# Altium schematic sheet CONNECTORS.SchDoc
size 389 x 241 mm; SheetNumber: 6; SheetTotal: 7
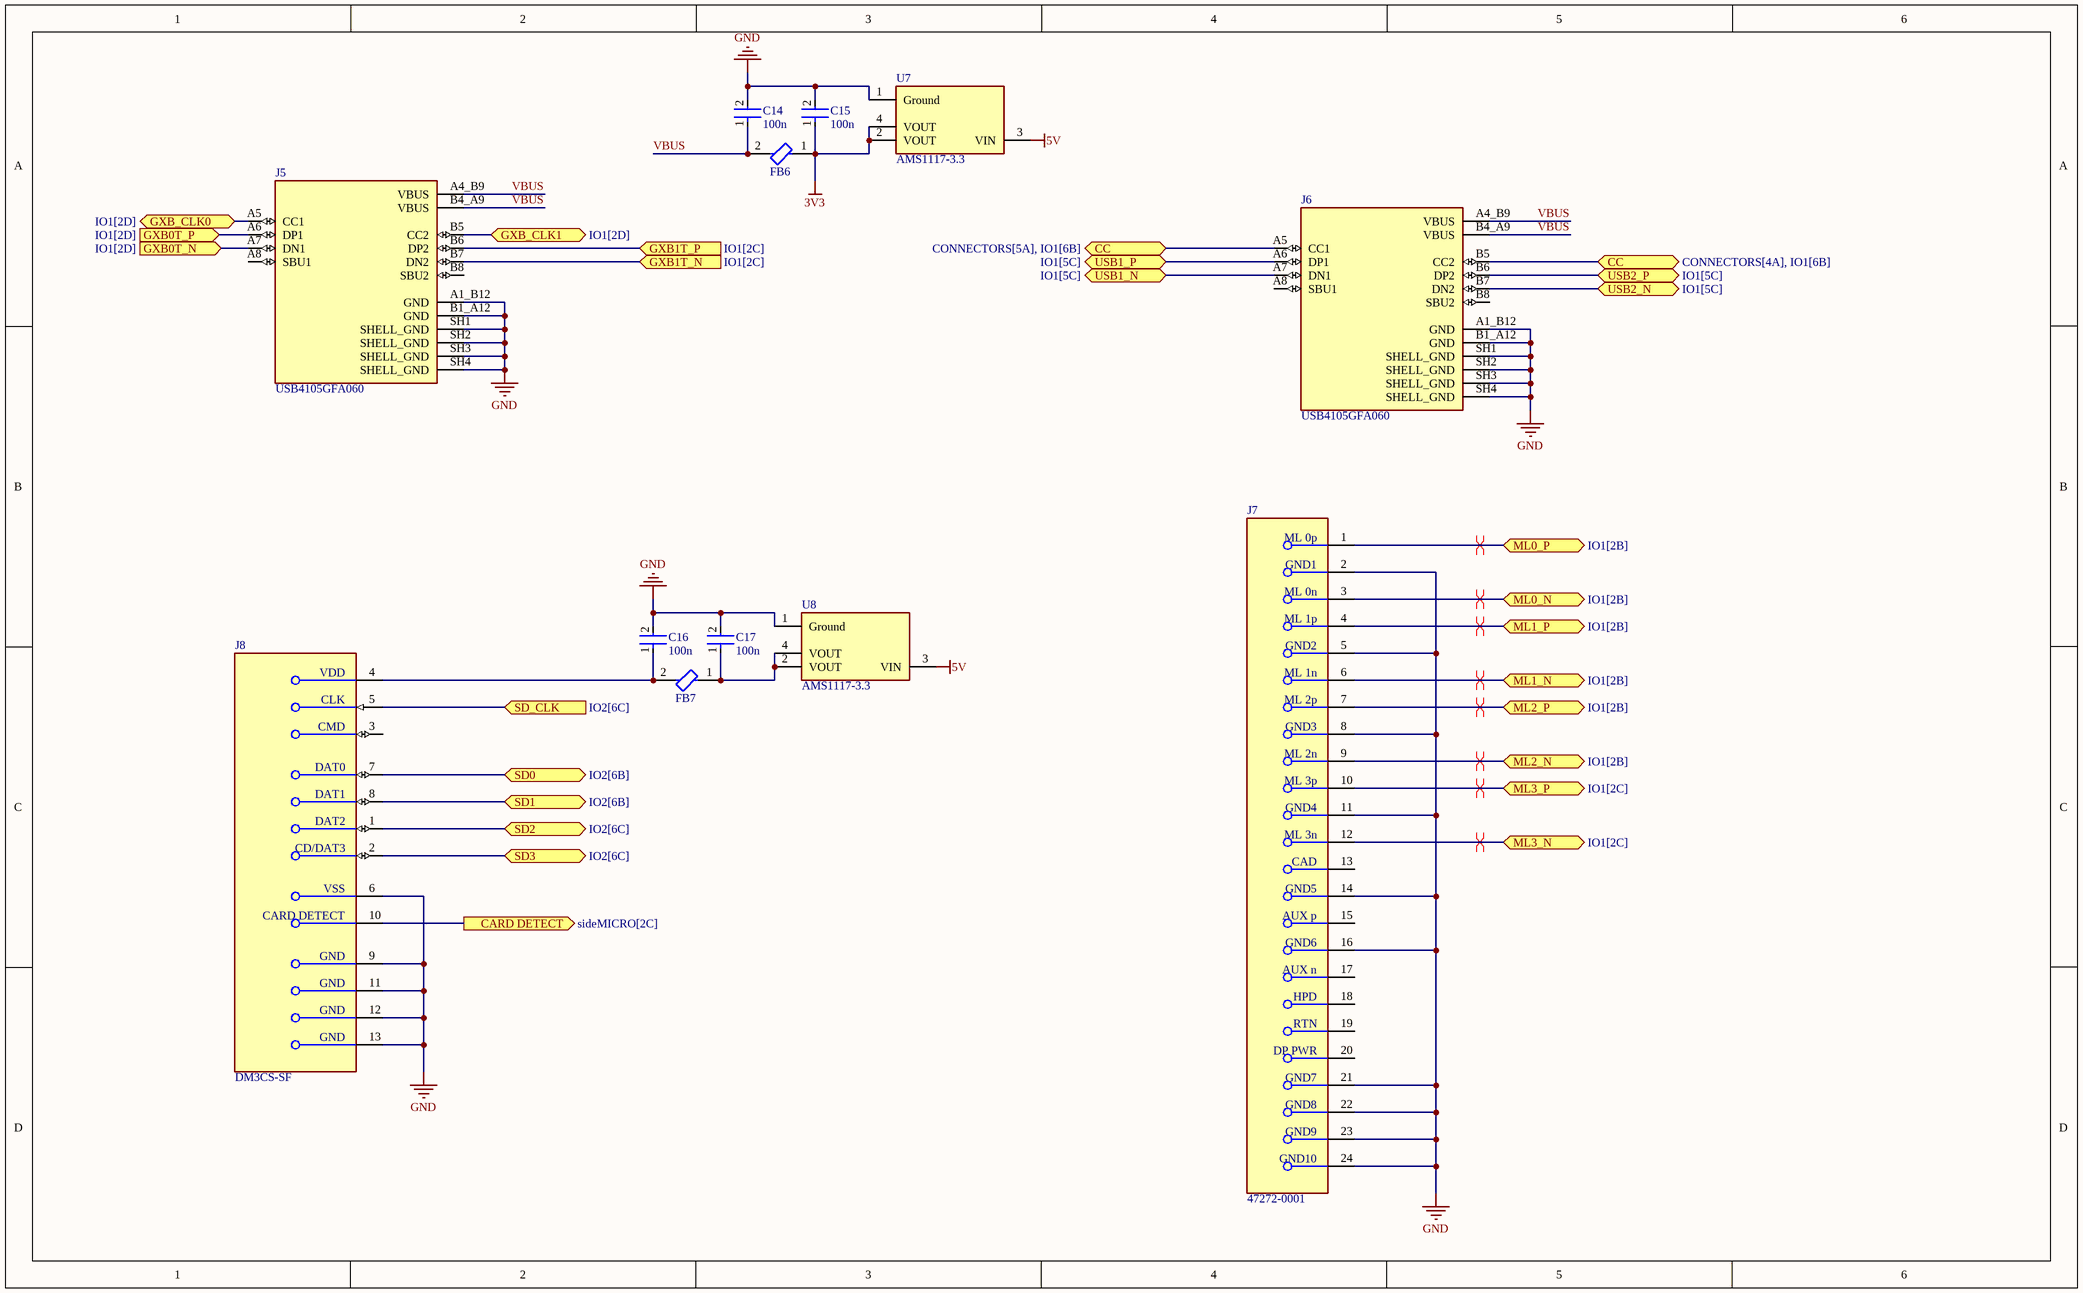
[diagram p0: CONNECTORS.SchDoc]

## Parts
C14  100n  [FP-CL10-IPC_C]
C15  100n  [FP-CL10-IPC_C]
C16  100n  [FP-CL10-IPC_C]
C17  100n  [FP-CL10-IPC_C]
FB6  BLM18KG121TN1D  [FP-BLM18-0_15-t0_6-d1_2-IPC_A]  (value not drawn)
FB7  BLM18KG121TN1D  [FP-BLM18-0_15-t0_6-d1_2-IPC_A]  (value not drawn)
J5  USB4105GFA060  [GCT_USB4105GFA060]
J6  USB4105GFA060  [GCT_USB4105GFA060]
J7  47272-0001  [FP-47272-0001-MFG]
J8  DM3CS-SF  [FP-DM3CS-SF-MFG]
U7  AMS1117-3.3  [FP-AMS1117-IPC_C]
U8  AMS1117-3.3  [FP-AMS1117-IPC_C]

## Ports
CARD DETECT (out, see sideMICRO[2C]), CC (bidir, see CONNECTORS[4A], IO1[6B]), CC (bidir, see CONNECTORS[5A], IO1[6B]), GXB0T_N (in, see IO1[2D]), GXB0T_P (in, see IO1[2D]), GXB1T_N (in, see IO1[2C]), GXB1T_P (in, see IO1[2C]), GXB_CLK0 (bidir, see IO1[2D]), GXB_CLK1 (bidir, see IO1[2D]), ML0_N (bidir, see IO1[2B]), ML0_P (bidir, see IO1[2B]), ML1_N (bidir, see IO1[2B]), ML1_P (bidir, see IO1[2B]), ML2_N (bidir, see IO1[2B]), ML2_P (bidir, see IO1[2B]), ML3_N (bidir, see IO1[2C]), ML3_P (bidir, see IO1[2C]), SD0 (bidir, see IO2[6B]), SD1 (bidir, see IO2[6B]), SD2 (bidir, see IO2[6C]), SD3 (bidir, see IO2[6C]), SD_CLK (in, see IO2[6C]), USB1_N (bidir, see IO1[5C]), USB1_P (bidir, see IO1[5C]), USB2_N (bidir, see IO1[5C]), USB2_P (bidir, see IO1[5C])

## Nets
3V3: C15.1 FB6.1 U7.2(VOUT) U7.4(VOUT)
5V: U7.3(VIN) U8.3(VIN)
GND: C14.2 C15.2 C16.2 C17.2 J5.A1_B12(GND) J5.B1_A12(GND) J5.SH1(SHELL_GND) J5.SH2(SHELL_GND) J5.SH3(SHELL_GND) J5.SH4(SHELL_GND) J6.A1_B12(GND) J6.B1_A12(GND) J6.SH1(SHELL_GND) J6.SH2(SHELL_GND) J6.SH3(SHELL_GND) J6.SH4(SHELL_GND) J7.2(GND1) J7.5(GND2) J7.8(GND3) J7.11(GND4) J7.14(GND5) J7.16(GND6) J7.21(GND7) J7.22(GND8) J7.23(GND9) J7.24(GND10) J8.6(VSS) J8.9(GND) J8.11(GND) J8.12(GND) J8.13(GND) U7.1(Ground) U8.1(Ground)
CARD DETECT: J8.10(CARD_DETECT) ; port CARD DETECT
CC: J6.A5(CC1) J6.B5(CC2) ; port CC
GXB0T_N: J5.A7(DN1) ; port GXB0T_N
GXB0T_P: J5.A6(DP1) ; port GXB0T_P
GXB1T_N: J5.B7(DN2) ; port GXB1T_N
GXB1T_P: J5.B6(DP2) ; port GXB1T_P
GXB_CLK0: J5.A5(CC1) ; port GXB_CLK0
GXB_CLK1: J5.B5(CC2) ; port GXB_CLK1
ML0_N: J7.3(ML_0n) ; port ML0_N
ML0_P: J7.1(ML_0p) ; port ML0_P
ML1_N: J7.6(ML_1n) ; port ML1_N
ML1_P: J7.4(ML_1p) ; port ML1_P
ML2_N: J7.9(ML_2n) ; port ML2_N
ML2_P: J7.7(ML_2p) ; port ML2_P
ML3_N: J7.12(ML_3n) ; port ML3_N
ML3_P: J7.10(ML_3p) ; port ML3_P
SD0: J8.7(DAT0) ; port SD0
SD1: J8.8(DAT1) ; port SD1
SD2: J8.1(DAT2) ; port SD2
SD3: J8.2(CD/DAT3) ; port SD3
SD_CLK: J8.5(CLK) ; port SD_CLK
USB1_N: J6.A7(DN1) ; port USB1_N
USB1_P: J6.A6(DP1) ; port USB1_P
USB2_N: J6.B7(DN2) ; port USB2_N
USB2_P: J6.B6(DP2) ; port USB2_P
VBUS: C14.1 FB6.2 J5.A4_B9(VBUS) J5.B4_A9(VBUS) J6.A4_B9(VBUS) J6.B4_A9(VBUS)
NetC16_1: C16.1 FB7.2 J8.4(VDD)
NetC17_1: C17.1 FB7.1 U8.2(VOUT) U8.4(VOUT)

Not connected (* = marked no-connect by the designer): J5 A8(SBU1) B8(SBU2); J6 A8(SBU1) B8(SBU2); J7 13(CAD) 15(AUX_p) 17(AUX_n) 18(HPD) 19(RTN) 20(DP_PWR); J8 3(CMD)

## Layout directives
differential pair: ML0_N, ML0_P, ML1_N, ML1_P, ML2_N, ML2_P, ML3_N, ML3_P

## Library data of the parts
C14-C17 = CMP-13271-003017-1: Cap Ceramic 4.7uF 10V X5R ±10% Pad SMD 0603 +85°C T/R; Capacitance: 4.7uF; Case/Package: 0603; Packaging: Tape and Reel; Width: 0.031inch; Contact Plating: Tin; Thickness: 0.035inch; Package Quantity: 1; Voltage Rating: 10V; Case Code (Metric): 1608; Case Code (Imperial): 0603; Depth: 0.8mm; Height: 0.8mm; Tolerance: 10%; Max Operating Temperature: 85°C; Length: 1.6mm; Dielectric: X5R; Mount: Surface Mount; Radiation Hardening: No; Min Operating Temperature: -55°C
FB6 FB7 = CMP-0686-00554-8: FERRITE BEAD 120 OHM 0603 1LN; Max Current Rating: 3A; DC Resistance (DCR): 30mR; Impedance: 120R; Number of Lines: 1; Test Frequency: 100MHz; Tolerance: 25%; Package Quantity: 4000; Min Operating Temperature: -55°C; Termination: SMD/SMT; REACH SVHC: No SVHC; Core Material: Ferrite; Material: Ferrite; Current Rating: 3A; Height: 0.8mm; Number of Pins: 2; Case/Package: 0603; Case Code (Imperial): 0603; Series: BLM18K; Packaging: Tape and Reel; Inductor Type: FERRITE BEAD; Lead Free: Lead Free; Width: 0.8mm; Case Code (Metric): 1608; Number of Circuits: 1; Max DC Current: 3A; Depth: 0.95mm; Max Operating Temperature: 125°C; Length: 1.6mm; RoHS Compliant: Yes
J5 J6 = USB4105GFA060: MF: {'manufacturer': u'GCT'}; Package: None; Price: None; Value: *; MP: USB4105GFA060; Availability: Unavailable
J7 = CMP-2000-05608-2: CONN RCPT DISPLAYPORT 20P SMD RA; Manufacturer: Molex; Voltage Rating: 40V; Is Female: yes; Shielding: true; Number Of Contacts: 20; Conn Orientation: Right Angle; Current Rating: 0.5A; Pitch: 0.5mm; Device Class L2: Audio / Video Connectors; Temperature: -20°C to +85°C; Contact Material: Gold,Nickel; Footprint Url: https://www.molex.com/pdm_docs/sd/472720001_sd.pdf; Device Class L1: Connectors; ComponentLink2Description: Datasheet; Temperature Range Low: -20°C; Automotive: No; Package: 0; Height: 6.9mm; RoHS: TRUE; Octopart: https://octopart.com/47272-0001-molex-5441289; Lead Free: Yes; ComponentLink2URL: https://www.molex.com/webdocs/datasheets/pdf/en-us/0472720001_IO_CONNECTORS.pdf; Device Class L3: unset; Mouser Description: HDMI, Displayport & DVI Connectors .5MM RA SMT RCPT; Category: Conn; Manufacturer Part Number: 47272-0001; Digikey Description: CONN RCPT DISPLAYPORT 20P SMD RA; Temperature Range High: +85°C
J8 = CMP-11597-000003-1: CONN MICRO SD CARD HINGED TYPE; Pitch: 1.1mm; Connector Type: Connector; Current Rating: 500mA; Voltage Rating (AC): 125V; Gender: Female; Insulation Resistance: 1GR; Number of Positions: 8; Contact Resistance: 100mR; Packaging: Tape and Reel; Flammability Rating: UL94 V-0; Lead Free: Lead Free; Min Operating Temperature: -25°C; Orientation: Right Angle; Width: 13.8mm; Number of Rows: 1; Housing Material: Polymer; Package Quantity: 1; Mount: Surface Mount; Max Current Rating: 500mA; Radiation Hardening: No; Max Operating Temperature: 85°C; Contact Plating: Gold; Depth: 1.83mm; Contact Material: Gold; Length: 14.1mm; Number of Contacts: 8; Termination: Solder
U7 U8 = CMP-209535-000001-1: LDO Voltage Regulators 1A, 3.3V; Manufacturer: Advanced Monolithic Systems; Dropout Voltage: 1.1V; Output Type: Fixed; Nominal Supply Current: 5mA; Max Power Dissipation: 1.2W; Max Supply Voltage: 15V; Number Of Outputs: 1; Standoff Height: 0.64mm; Max Junction Temp: +125°C; Height: 1.8mm; Package: AMS1117; Device Class L2: Power Management ICs; ComponentLink2Description: Datasheet; ComponentLink2URL: http://www.advanced-monolithic.com/pdf/ds1117.pdf; Category: IC; RoHS: TRUE; Automotive: No; Device Class L1: Integrated Circuits (ICs); Output Current: 1A; Device Class L3: Voltage Regulators - Linear; Temperature: -40°C to +125°C; Output Voltage: 3.3V; Manufacturer Part Number: AMS1117-3.3; Temperature Range Low: -40°C; Octopart: https://octopart.com/ams1117-3.3-advanced+monolithic+systems-25899300; Lead Free: Yes; Ipc Land Pattern Name: SOT229P700X180-4; Temperature Range High: +125°C